# EAGLE design TdsReworkSMD (EAGLE 9.2.0)
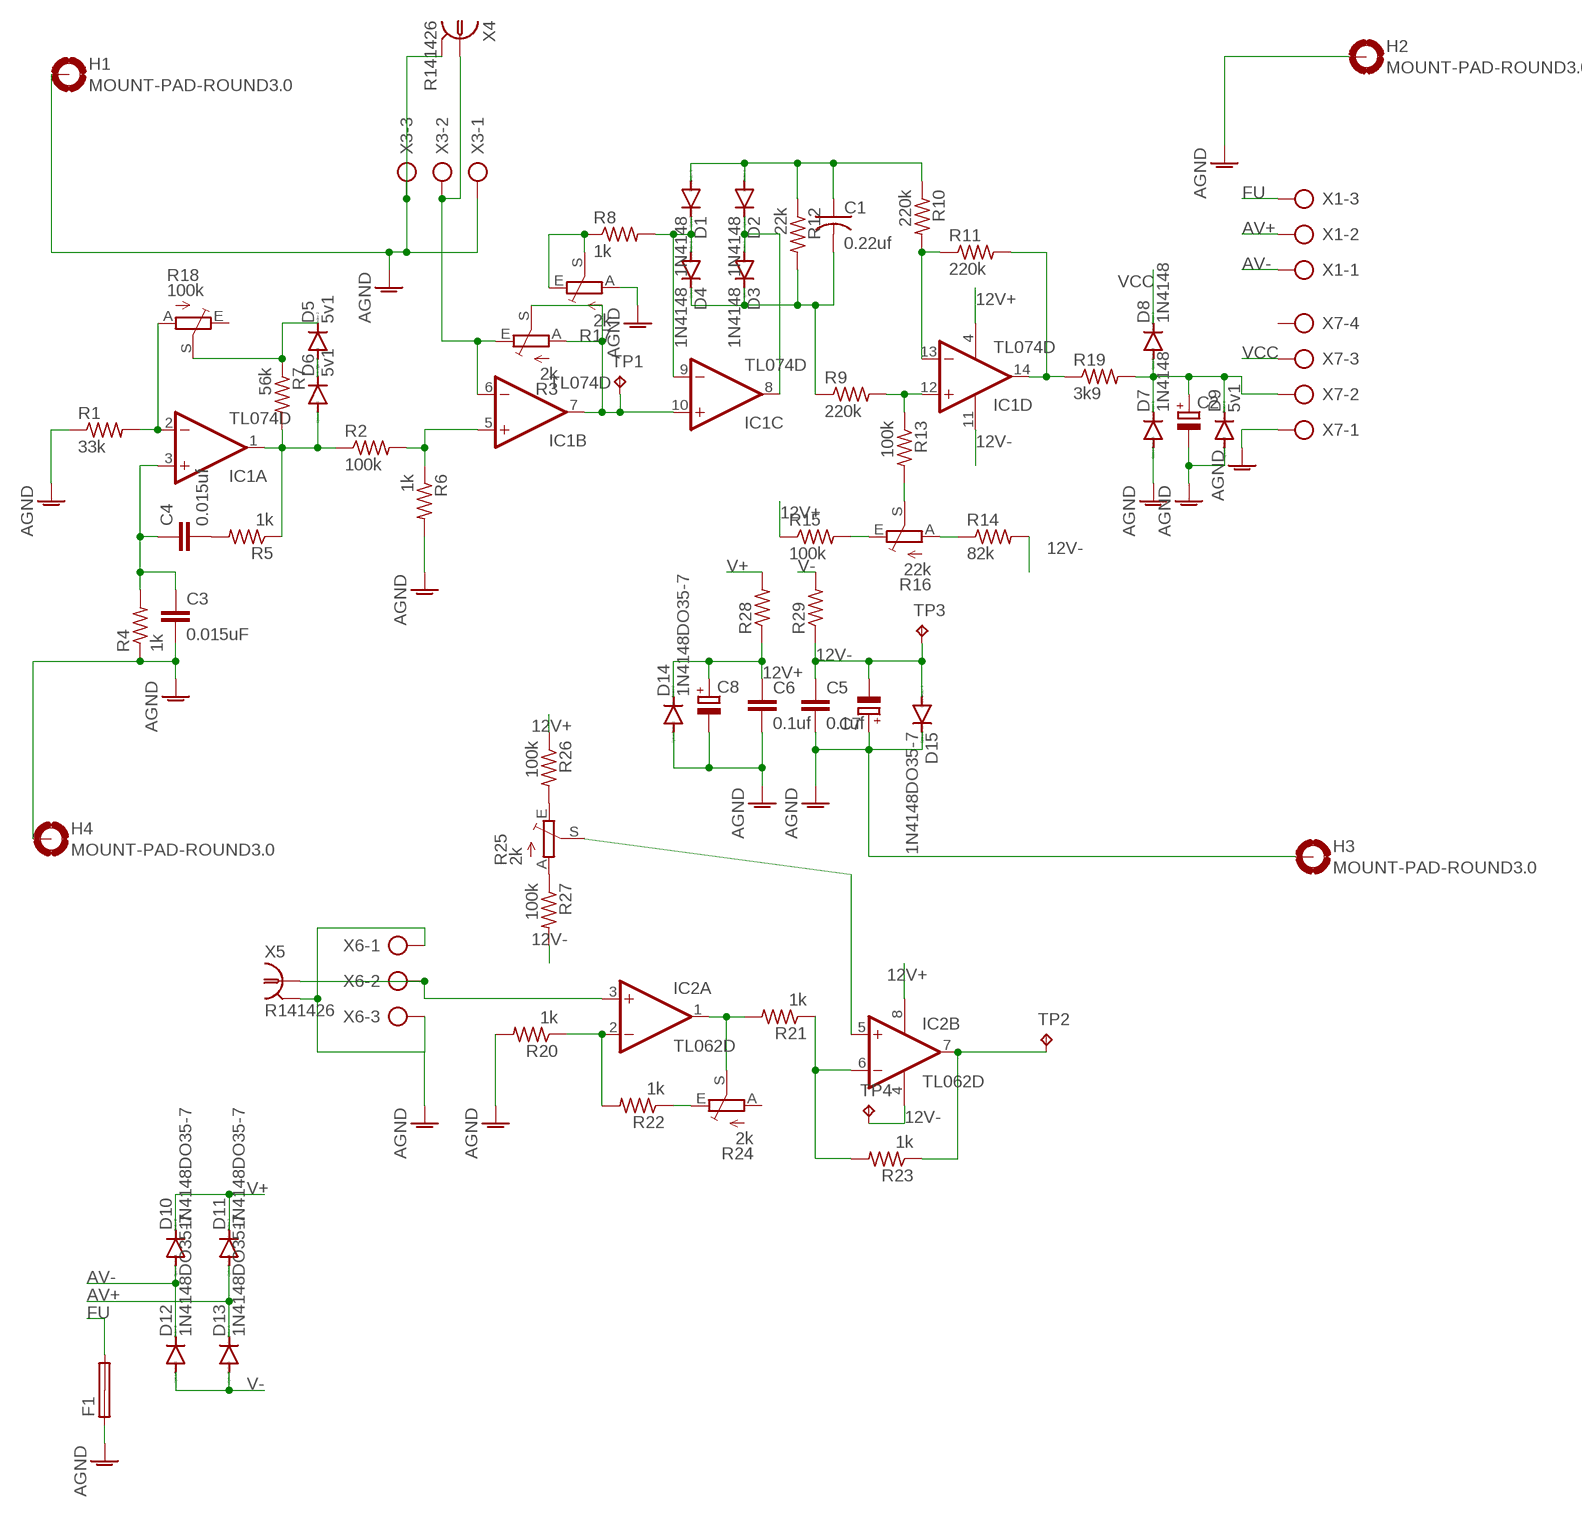
[diagram p0: schematic, sheet 1]

## Parts
C1  0.22uf  C-US075-032X103  [C075-032X103]
C2  CPOL-EUE5-8.5  [E5-8,5]
C3  0.015uF  C-EU050-024X044  [C050-024X044]
C4  0.015uf  C-EU050-024X044  [C050-024X044]
C5  0.1uf  C5/2.5  [C5B2.5]
C6  0.1uf  C5/2.5  [C5B2.5]
C7  CPOL-EUE5-8.5  [E5-8,5]
C8  CPOL-EUE5-8.5  [E5-8,5]
D1  1N4148  1N4148DO35-7  [DO35-7]
D2  1N4148  1N4148DO35-7  [DO35-7]
D3  1N4148  1N4148DO35-7  [DO35-7]
D4  1N4148  1N4148DO35-7  [DO35-7]
D5  5v1  1N4148DO35-7  [DO35-7]
D6  5v1  1N4148DO35-7  [DO35-7]
D7  1N4148  1N4148DO35-7  [DO35-7]
D8  1N4148  1N4148DO35-7  [DO35-7]
D9  5v1  1N4148DO35-10  [DO35-10]
D10  1N4148DO35-7  [DO35-7]
D11  1N4148DO35-7  [DO35-7]
D12  1N4148DO35-7  [DO35-7]
D13  1N4148DO35-7  [DO35-7]
D14  1N4148DO35-7  [DO35-7]
D15  1N4148DO35-7  [DO35-7]
F1  SHK20L  [SHK20L]
H1  MOUNT-PAD-ROUND3.0  [3,0-PAD]
H2  MOUNT-PAD-ROUND3.0  [3,0-PAD]
H3  MOUNT-PAD-ROUND3.0  [3,0-PAD]
H4  MOUNT-PAD-ROUND3.0  [3,0-PAD]
IC1  TL074D  [SO14]
IC2  TL062D  [SO08]
R1  33k  R-US_0204/5  [0204/5]
R2  100k  R-US_0204/5  [0204/5]
R3  2k  TRIM_EU-B64Y  [B64Y]
R4  1k  R-US_0204/5  [0204/5]
R5  1k  R-US_0204/5  [0204/5]
R6  1k  R-US_0204/5  [0204/5]
R7  56k  R-US_0204/2V  [0204V]
R8  1k  R-US_0204/5  [0204/5]
R9  220k  R-US_0204/5  [0204/5]
R10  220k  R-US_0204/5  [0204/5]
R11  220k  R-US_0204/5  [0204/5]
R12  22k  R-US_0204/5  [0204/5]
R13  100k  R-US_0204/5  [0204/5]
R14  82k  R-US_0204/5  [0204/5]
R15  100k  R-US_0204/5  [0204/5]
R16  22k  TRIM_EU-B64Y  [B64Y]
R17  2k  TRIM_EU-B64Y  [B64Y]
R18  100k  TRIM_EU-B64Y  [B64Y]
R19  3k9  R-US_0204/5  [0204/5]
R20  1k  R-US_0204/5  [0204/5]
R21  1k  R-US_0204/5  [0204/5]
R22  1k  R-US_0204/5  [0204/5]
R23  1k  R-US_0204/5  [0204/5]
R24  2k  TRIM_EU-B64Y  [B64Y]
R25  2k  TRIM_EU-B64Y  [B64Y]
R26  100k  R-US_0204/5  [0204/5]
R27  100k  R-US_0204/5  [0204/5]
R28  R-US_0309/10  [0309/10]
R29  R-US_0309/10  [0309/10]
TP1  TPPAD1-13  [P1-13]
TP2  TPPAD1-13  [P1-13]
TP3  TPPAD1-13  [P1-13]
TP4  TPPAD1-13  [P1-13]
X1  AK500/3  [AK500/3]
X3  AK500/3  [AK500/3]
X4  R141426  [R141426]
X5  R141426  [R141426]
X6  AK500/3  [AK500/3]
X7  AK500/4  [AK500/4]

## Nets
12V+: C6.1 C8.+ D14.C IC1.4(P:V+) IC2.8(P:V+) R15.1 R26.1 R28.1
12V-: C5.1 C7.- D15.A IC1.11(P:V-) IC2.4(P:V-) R14.2 R27.2 R29.1 TP3.TP TP4.TP
AGND: C2.- C3.2 C5.2 C6.2 C7.+ C8.- D7.A D9.A D14.A D15.C F1.1A H1.B3,0(MOUNT) H2.B3,0(MOUNT) H3.B3,0(MOUNT) H4.B3,0(MOUNT) R1.1 R4.1 R6.2 R17.A R20.2 X3.1 X3.3 X4.2 X4.3 X4.4 X4.5 X5.2 X5.3 X5.4 X5.5 X6.1 X6.3 X7.1
AV+: D11.A D13.C X1.2
AV-: D10.A D12.C X1.1
FU: F1.2A X1.3
N$1: IC1.2(A:-IN) R1.2 R18.A
N$2: IC1.6(B:-IN) R3.E X3.2 X4.1
N$3: IC1.5(B:+IN) R2.2 R6.1
N$4: D6.A IC1.1(A:OUT) R2.1 R5.1 R7.2
N$5: C3.1 C4.1 IC1.3(A:+IN) R4.2
N$6: IC2.1(A:OUT) R21.2 R24.S
N$7: IC1.7(B:OUT) IC1.10(C:+IN) R3.A R3.S TP1.TP
N$8: C4.2 R5.2
N$9: IC1.14(D:OUT) R11.2 R19.1
N$10: C1.1 D1.A D2.A R10.1 R12.1
N$11: D1.C D4.A IC1.9(C:-IN) R8.2
N$12: D2.C D3.A IC1.8(C:OUT)
N$13: IC1.13(D:-IN) R10.2 R11.1
N$14: IC1.12(D:+IN) R9.2 R13.1
N$15: D5.C R7.1 R18.S
N$16: C1.2 D3.C D4.C R9.1 R12.2
N$17: D5.A D6.C
N$18: R13.2 R16.S
N$19: R14.1 R16.A
N$20: R15.2 R16.E
N$21: R8.1 R17.E R17.S
N$22: C2.+ D7.C D8.A D9.C R19.2 X7.2
N$23: IC2.2(A:-IN) R20.1 R22.2
N$24: R22.1 R24.E
N$25: IC2.6(B:-IN) R21.1 R23.2
N$26: IC2.3(A:+IN) X5.1 X6.2
N$27: IC2.5(B:+IN) R25.S
N$28: IC2.7(B:OUT) R23.1 TP2.TP
N$29: R25.A R27.1
N$30: R25.E R26.2
V+: D10.C D11.C R28.2
V-: D12.A D13.A R29.2
VCC: D8.C X7.3
Unconnected: F1.1B F1.2B R18.E R24.A X7.4

## Library data of the parts
C1 = rcl:C-US: CAPACITOR, American symbol; SPICEPREFIX: C
C2 C7 C8 = rcl:CPOL-EU: POLARIZED CAPACITOR, European symbol; SPICEPREFIX: C
C3 C4 = rcl:C-EU: CAPACITOR, European symbol; SPICEPREFIX: C
C5 C6 = capacitor-wima:C: CAPACITOR naming: grid - package width
D1-D15 = diode:1N4148: DIODE high speed (Philips)
F1 = fuse:SHK20L: FUSE HOLDER 5 x 20 mm, SH contact, SHH1 Schukat, E1073 Buerklin; OC_FARNELL: unknown; OC_NEWARK: unknown
H1-H4 = holes:MOUNT-PAD-ROUND: MOUNTING PAD, round
IC1 = linear:TL074: OP AMP
IC2 = linear:TL062: OP AMP
R1 R2 R4-R15 R19-R23 R26-R29 = rcl:R-US_: RESISTOR, American symbol; SPICEPREFIX: R
R3 R16-R18 R24 R25 = pot:TRIM_EU-: POTENTIOMETER
TP1-TP4 = testpad:TP: Test pad
X1 X3 X6 = con-ptr500:AK500/3: CONNECTOR; OC_FARNELL: unknown; OC_NEWARK: unknown
X4 X5 = con-coax:R141426: BNC COAX CONNECTOR Radiall 50/75 Ohm Spoerle; MF: FARNELL; MPN: R141426161; OC_FARNELL: 4195115; OC_NEWARK: 14J7919
X7 = con-ptr500:AK500/4: CONNECTOR; OC_FARNELL: unknown; OC_NEWARK: unknown

## Board
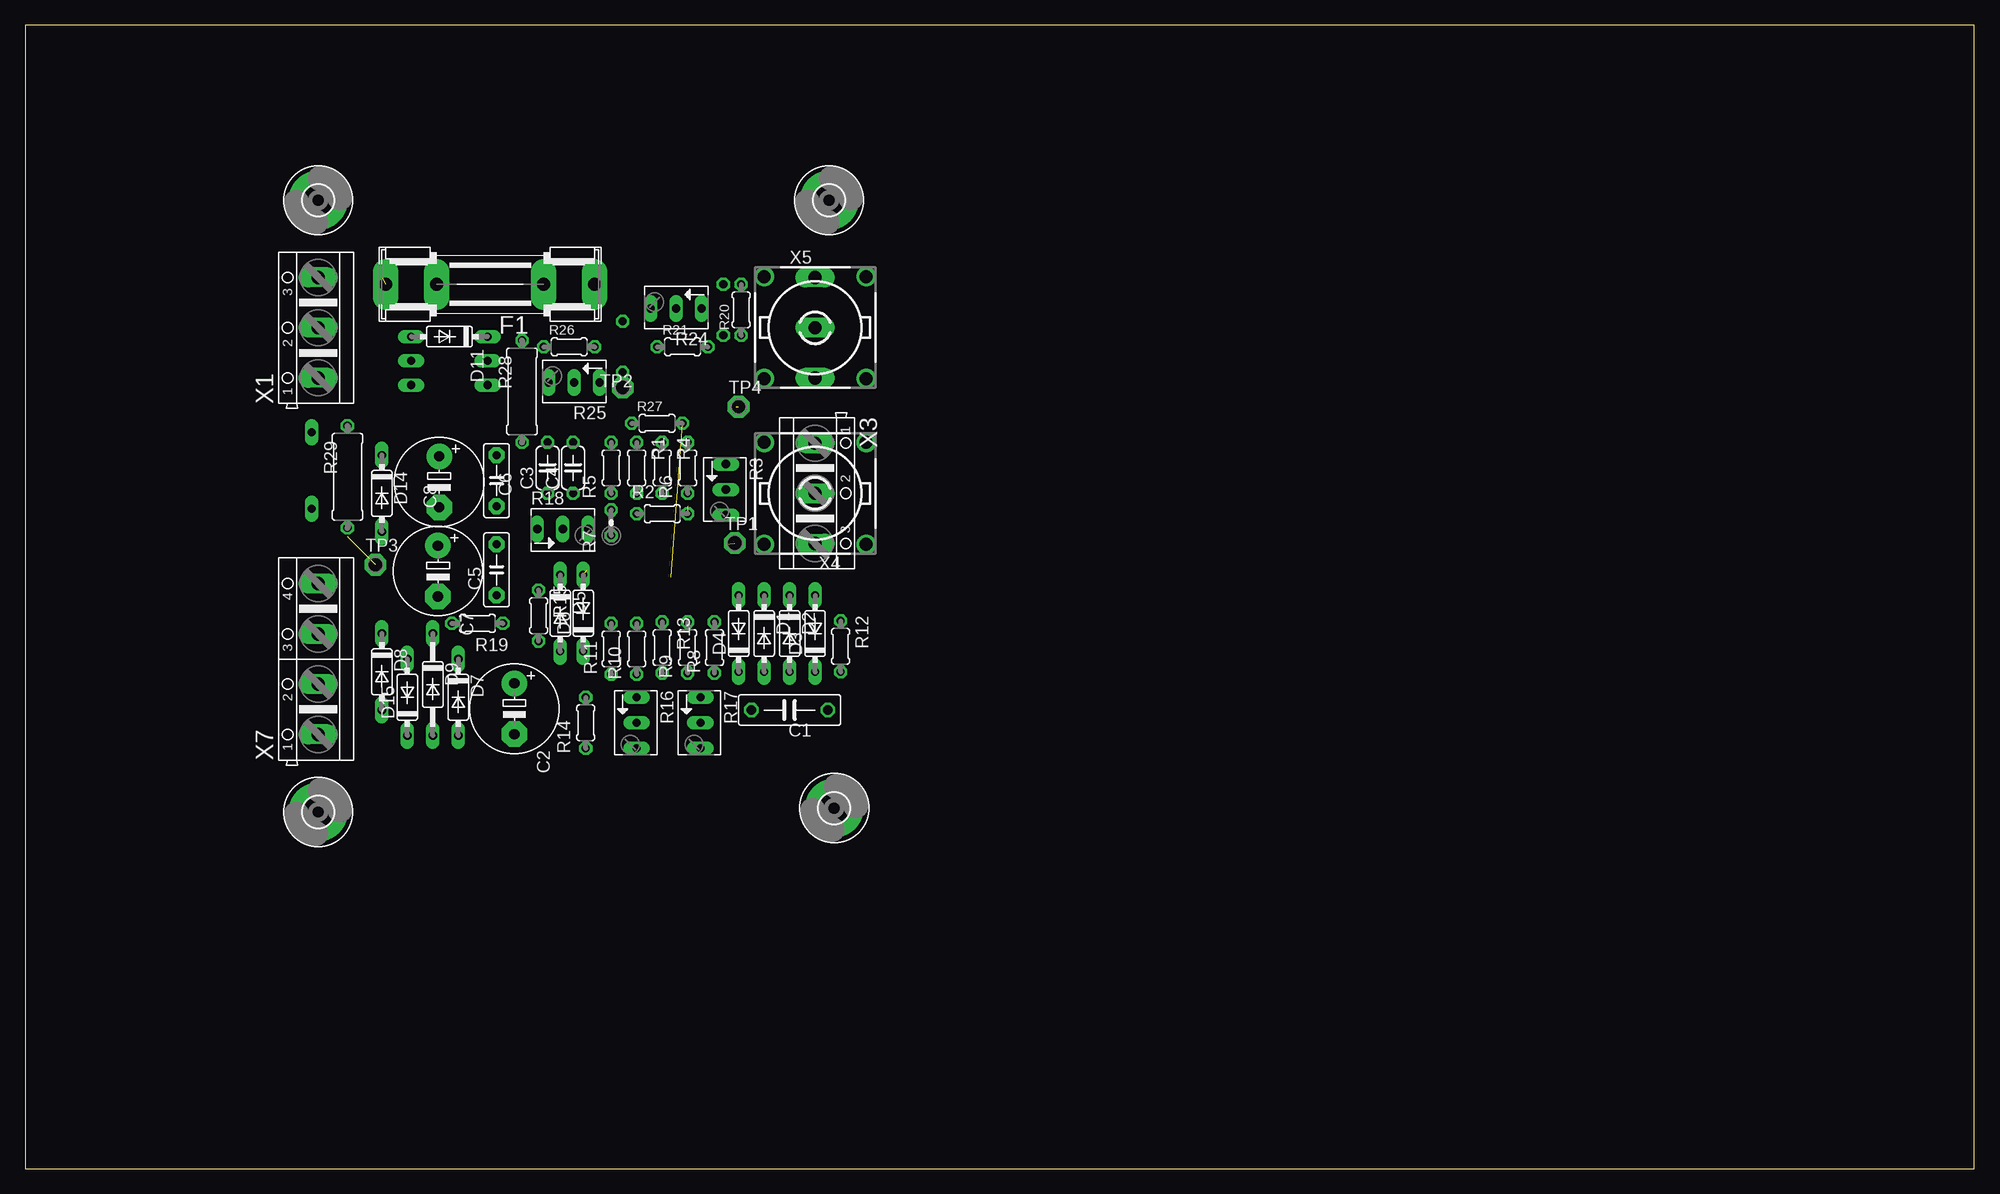
[diagram p1: board, top side]
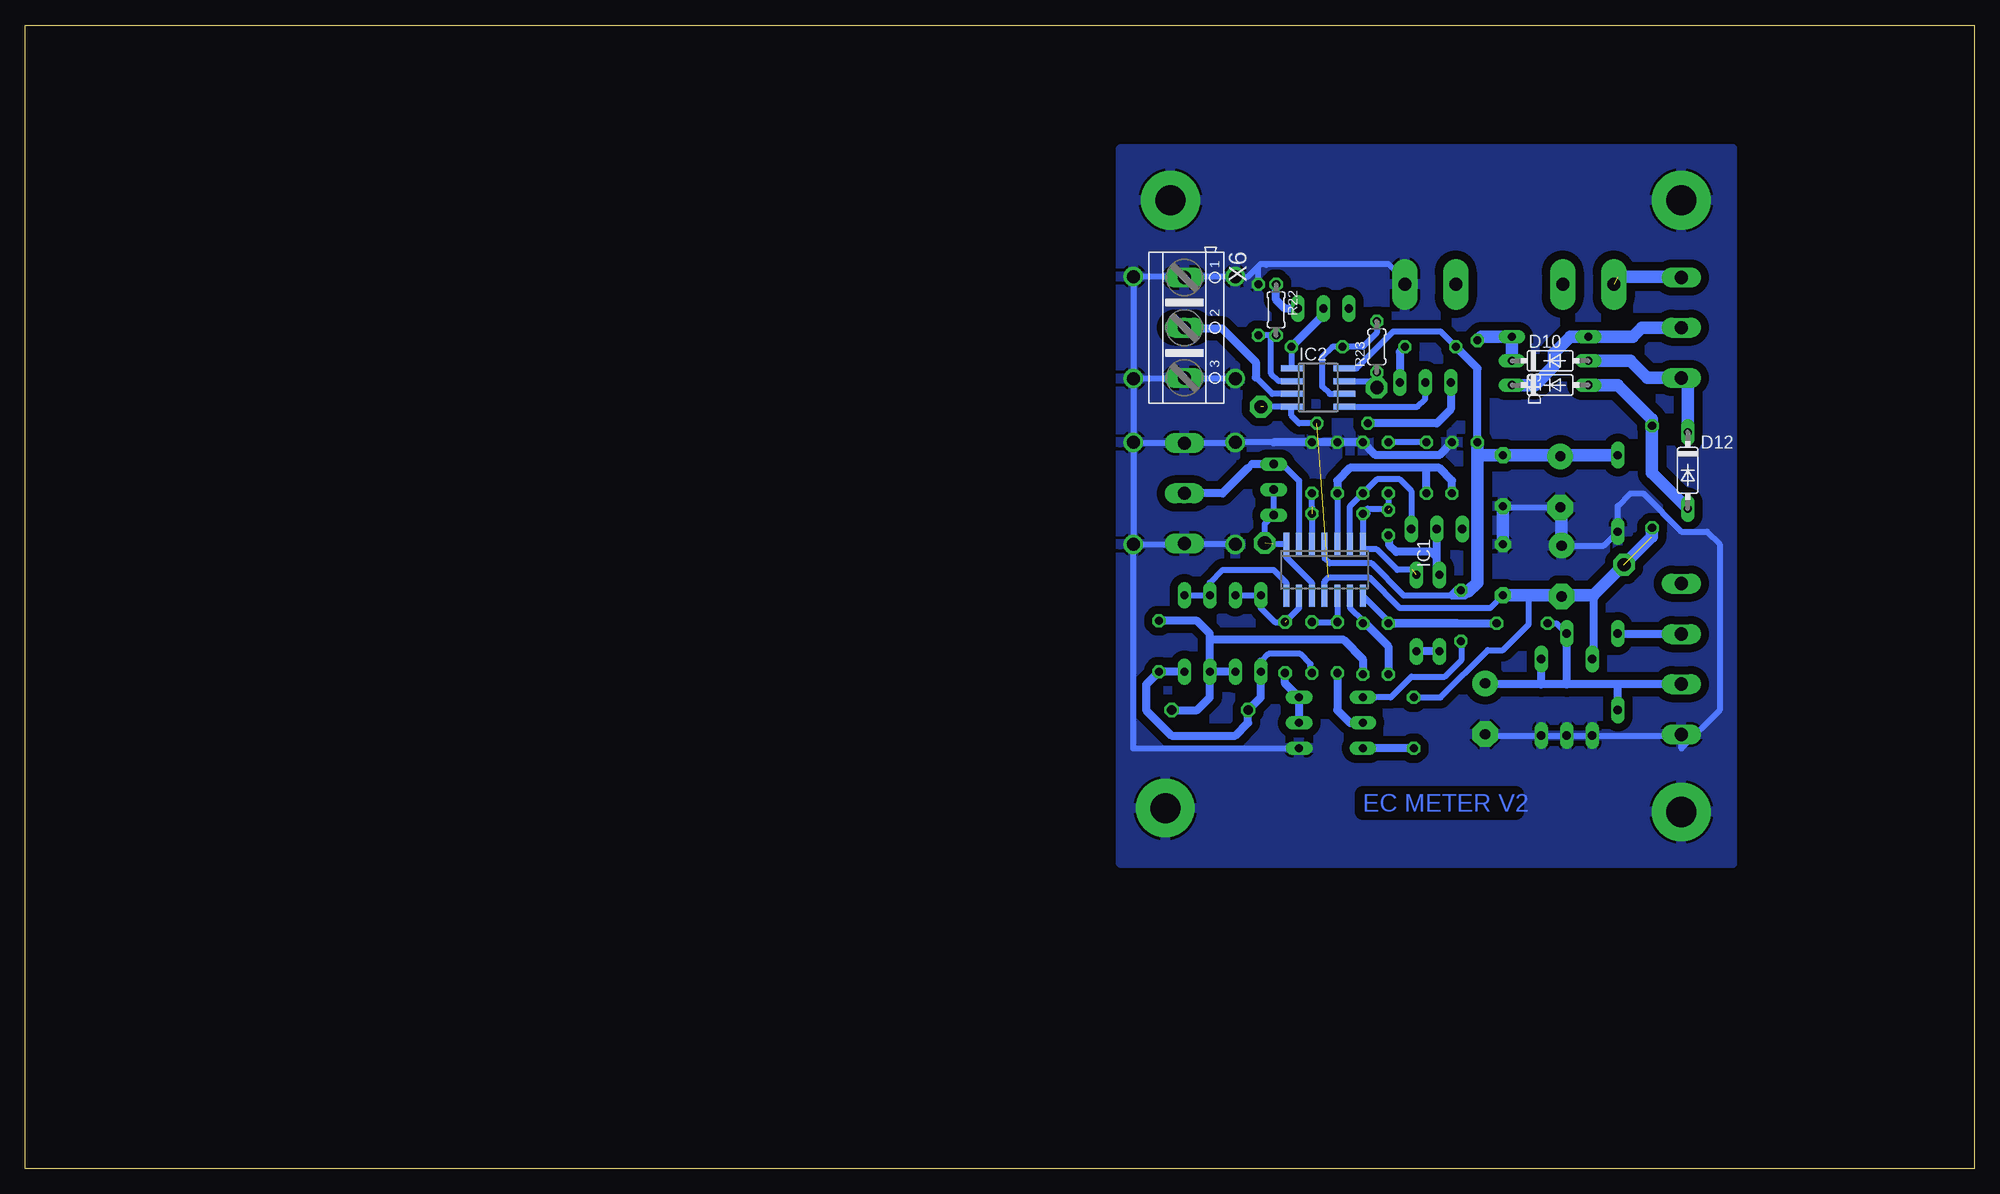
[diagram p2: board, bottom side, seen from below]

Size 194.29 x 113.97 mm. Coordinates in mm from the lower left corner, seen from the top.
Outline: 0,0 194.29,0 194.29,113.97 0,113.97 0,0
Copper layers (1*16): Top 0.035mm / dielectric 1.5mm / Bottom 0.035mm
Design rules "default *": minimum track width 6mil, minimum drill 0.35mm, track to track 8mil, track to pad 8mil, pad to pad 8mil, via to via 8mil, smd to smd 8mil, copper to edge 40mil, drill to drill 6mil, minimum pad ring 10mil, minimum via ring 8mil, stop-mask expansion 4mil, vias tented up to drill 0mil, thermal gap 10mil

### Footprints (pad centres in the part's own frame; a part is rotated, then mirrored left to right if it is on the bottom)
C075-032X103 = drill 0.914 octagon: 1 -3.81,0; 2 3.81,0
E5-8,5 = drill 1.016 pad 2.54: + -2.54,0 | drill 1.016 pad 2.54 octagon: - 2.54,0
C050-024X044 = drill 0.813 octagon: 1 -2.54,0; 2 2.54,0
C5B2.5 = drill 0.813 pad 1.6 octagon: 1 -2.54,0; 2 2.54,0
DO35-7 = drill 0.813 long: A 3.81,0; C -3.81,0
DO35-10 = drill 0.813 long: A 5.08,0; C -5.08,0
SHK20L = drill 1.321 pad 2.54 long: 1A -10.414,0; 1B -5.334,0; 2A 10.414,0; 2B 5.334,0
3,0-PAD = drill 3 pad 5.842: B3,0 0,0
SO14 = smd 0.6 x 2.2: 1 -3.81,-2.6; 2 -2.54,-2.6; 3 -1.27,-2.6; 4 0,-2.6; 5 1.27,-2.6; 6 2.54,-2.6; 7 3.81,-2.6; 8 3.81,2.6; 9 2.54,2.6; 10 1.27,2.6; 11 0,2.6; 12 -1.27,2.6; 13 -2.54,2.6; 14 -3.81,2.6
SO08 = smd 0.6 x 2.2: 1 -1.905,-2.6; 2 -0.635,-2.6; 3 0.635,-2.6; 4 1.905,-2.6; 5 1.905,2.6; 6 0.635,2.6; 7 -0.635,2.6; 8 -1.905,2.6
0204/5 = drill 0.813 octagon: 1 -2.54,0; 2 2.54,0
B64Y = drill 0.813 long: A 2.54,0; E -2.54,0; S 0,0
0204V = drill 0.813 octagon: 1 -1.27,0; 2 1.27,0
0309/10 = drill 0.813 octagon: 1 -5.08,0; 2 5.08,0
P1-13 = drill 1.321 pad 2.159 octagon: TP 0,0
AK500/3 = drill 1.321 long: 1 -5.004,0; 2 0,0; 3 5.004,0
R141426 = drill 1.295: 1 0,0; 2 5.08,5.08; 3 -5.08,5.08; 4 -5.08,-5.08; 5 5.08,-5.08
AK500/4 = drill 1.321 long: 1 -7.518,0; 2 -2.489,0; 3 2.489,0; 4 7.518,0

### Placement (x,y rotation side)
C1  76.2,45.72 180 top
C2  48.77,45.85 270 top
C3  52.07,69.85 90 top
C4  54.61,69.85 90 top
C5  46.99,59.69 90 top
C6  46.99,68.58 270 top
C7  41.15,59.56 270 top
C8  41.27,68.45 270 top
D1  73.66,53.34 270 top
D2  76.2,53.34 270 top
D3  78.74,53.34 90 top
D4  71.12,53.34 90 top
D5  53.34,55.37 270 top
D6  55.63,55.37 90 top
D7  43.18,46.99 270 top
D8  35.56,49.53 270 top
D9  40.64,48.26 270 top
D10  42.29,80.52 0 bottom
D11  42.29,82.93 180 top
D12  28.57,69.6 270 bottom
D13  42.29,78.11 0 bottom
D14  35.56,67.31 270 top
D15  38.1,46.99 90 top
F1  46.35,88.14 180 top
H1  80.14,96.52 0 top
H2  29.21,35.56 0 top
H3  80.64,35.94 0 top
H4  29.21,96.52 0 top
IC1  64.77,59.69 180 bottom
IC2  65.41,77.85 270 bottom
R1  60.96,69.85 270 top
R2  63.5,65.28 0 top
R3  69.85,67.69 270 top
R4  63.5,69.85 270 top
R5  58.42,69.85 90 top
R6  66.04,69.85 90 top
R7  58.42,64.39 90 top
R8  68.71,51.94 90 top
R9  66.04,51.94 90 top
R10  60.96,51.82 90 top
R11  58.42,51.82 90 top
R12  81.28,52.07 270 top
R13  63.5,51.94 270 top
R14  55.88,44.45 90 top
R15  51.18,55.12 270 top
R16  60.96,44.45 270 top
R17  67.31,44.45 270 top
R18  53.59,63.75 0 top
R19  45.09,54.36 180 top
R20  71.37,85.6 90 top
R21  65.53,81.92 0 top
R22  69.6,85.6 270 bottom
R23  59.56,81.92 90 bottom
R24  64.9,85.72 180 top
R25  54.74,78.36 180 top
R26  54.23,81.92 0 top
R27  62.99,74.3 0 top
R28  49.53,77.47 90 top
R29  32.13,68.96 90 top
TP1  70.74,62.36 0 top
TP2  59.56,77.85 0 top
TP3  34.92,60.2 0 top
TP4  71.12,75.95 0 top
X1  29.21,83.82 90 top
X3  78.74,67.31 270 top
X4  78.74,67.31 180 top
X5  78.74,83.82 0 top
X6  78.74,83.82 270 bottom
X7  29.21,50.8 90 top

### Tracks (layer width: path | path; a pad name or v marks a point on that pad's centre or on a via)
12V+
  Bottom 0.61: C8.+ 46.86,70.99 C6.1 48.26,71.12 | 41.53,71.25 C8.+ | C8.+ 35.69,70.99 D14.C | 64.77,60.96 IC1.4 64.77,60.83 64.26,60.33 60.07,60.33 56.9,57.15 52.07,57.15 | 49.53,58.42 49.53,71.12 R28.1 49.53,79.76 | R15.1 50.8,57.28 50.8,57.15 | R26.1 53.21,83.44 57.91,83.44 61.59,79.76 IC2.8
  Bottom 0.813: 49.02,71.12 49.53,71.12 49.53,79.76 R26.1 | 50.42,57.53 50.8,57.15 52.07,57.15 51.56,57.66 R15.1
  Bottom 1.27: D14.C 48.26,71.12 49.02,71.12 | R28.1 49.53,58.42 50.42,57.53
12V-  (3 unrouted)
  Bottom 0.61: 37.97,57.15 41.02,57.15 C7.- 41.27,57.15 44.45,57.15 | 64.77,58.42 IC1.11 64.77,58.55 64.39,58.93 60.33,58.93 57.28,55.88 48.26,55.88 C5.1 | 53.44,46.99 R14.2 53.21,46.99 48.51,51.69 46.99,51.69 44.45,54.23 44.45,56.77 44.83,57.15 46.74,57.15 | 68.71,75.95 IC2.4 | R27.2 67.31,74.3 68.07,75.06 68.07,75.88 IC2.4 | IC2.4 70.87,75.95 71.12,76.2 | 37.97,57.15
  Bottom 0.813: C5.1 46.74,57.15 44.45,57.15 37.97,57.15 37.97,50.93 D15.A
  Bottom 1.27: R29.1 32.13,62.99 37.97,57.15 46.74,57.15
AGND
  Bottom 0.61: R1.1 R4.1 R6.2 69.85,72.39 X4.5 73.74,72.31 X3.1 83.74,72.31 X4.4 | X4.4 X4.3 | X4.3 78.82,62.23 X3.3 73.74,62.31 X4.2 | R17.A 83.82,41.91 X4.3 | C6.2 46.86,65.91 C8.- | 29.21,43.18 D9.A 48.26,43.18 | X5.5 X5.2 X5.3 72.39,88.9 71.5,89.79 | X5.5 X4.4 | X5.4 X5.5 | C7.+ 36.96,62.1 D14.A 35.56,66.04 34.29,67.31 33.02,67.31 29.21,63.5 26.67,63.5 25.4,62.23 25.4,45.72 29.21,41.91 29.21,43.18 | 29.21,43.18 X7.1 | 71.5,89.79 71.12,90.17 70.48,90.17 | 70.48,90.17 58.42,90.17 56.77,88.52 F1.1A | 70.61,90.04 70.48,90.17 | R20.2 71.37,89.66 71.5,89.79
  Bottom 0.813: C3.2 53.34,71.12 59.69,71.12 R1.1 69.85,72.39
  Bottom 1.27: C8.- 41.15,65.79 C7.+ | C6.2 C5.2
  pour Bottom (isolate 0.813): 24.13,101.6 85.09,101.6 85.09,30.48 24.13,30.48
AV+
  Bottom 0.61: 34.04,82.93 34.29,82.93
  Bottom 1.27: X1.2 33.15,83.82 34.04,82.93 | 34.29,82.93 D11.A 40.26,82.93 41.91,81.28 41.91,80.01 43.81,78.11 D13.C
AV-
  Bottom 0.61: X1.1 29.29,78.74
  Bottom 1.27: D10.A 34.29,80.52 32.59,78.82 X1.1 28.57,78.18 D12.C
FU  (1 unrouted)
  Bottom 1.27: X1.3 29.29,88.9 35.56,88.9
N$1
  Bottom 0.61: IC1.2 62.23,66.04 R1.2 | R1.2 59.69,68.58 | R1.2 59.56,68.71 57.28,68.71 56.13,67.56 R18.A
N$2
  Bottom 0.61: R3.E 68.96,70.23 67.31,68.58 IC1.6 | 72.01,70.23 72.39,69.85
  Bottom 0.813: R3.E 72.01,70.23 | 72.39,69.85 74.93,67.31 X3.2
N$3  (1 unrouted)
  Bottom 0.61: 66.04,66.04 IC1.5 | R2.2 R6.1
N$4  (3 unrouted)
  Bottom 0.61: 60.45,65.28 R2.1 | R2.1 IC1.1 60.96,61.85 60.83,61.72 59.56,61.72 57.53,59.69 56.01,59.69 55.75,58.17 | R2.1 60.45,65.79 58.29,65.79 | R5.1 58.42,65.68
N$5
  Bottom 0.61: R4.2 IC1.3
  Bottom 0.813: C3.1 52.07,68.58 53.34,69.85 54.61,69.85 | 54.61,69.85 62.23,69.85 63.5,68.58 R4.2 | C4.1 54.61,69.85
N$6
  Bottom 0.61: R21.2 68.07,79.82 IC2.1 | 64.9,85.09 R24.S
  Bottom 0.813: R21.2 64.9,85.09
N$7  (1 unrouted)
  Bottom 0.61: 68.64,62.23 IC1.7 68.58,60.96 66.04,58.42 IC1.10 | 68.64,62.23 69.85,62.23 | TP1.TP 70.74,64.26 R3.A R3.S | 68.58,62.17 68.64,62.23
N$8
  Bottom 0.61: C4.2 R5.2
N$9
  Bottom 0.61: IC1.14 58.42,54.55 | 58.42,54.55 R11.2 | 58.35,54.48 58.42,54.55 | 51.56,54.48 58.35,54.48 | R19.1 58.23,54.36 58.35,54.48
  Bottom 0.813: R11.2 R19.1
N$10
  Bottom 0.813: C1.1 77.47,45.72 76.2,46.99 D2.A | R12.1 77.47,54.61 76.2,53.34 76.2,52.7 | D2.A 76.2,52.7 | R10.1 60.96,50.8 62.86,52.7 76.2,52.7 | D1.A D2.A
N$11  (1 unrouted)
  Bottom 0.61: D1.C D4.A 71.12,55.88 69.72,54.48 R8.2 | 67.31,57.15 IC1.9 67.31,55.88 68.58,54.61
N$12
  Bottom 0.61: D3.A D2.C 76.2,58.42 74.93,59.69 69.85,59.69 68.58,58.42 IC1.8
N$13
  Bottom 0.61: IC1.13 62.23,55.88 60.96,54.61 | 60.96,54.61 R10.2 | 58.42,52.07 60.96,54.61
  Bottom 0.813: R10.2 60.71,54.36 58.42,52.07 R11.1
N$14
  Bottom 0.61: R9.2 R13.1 IC1.12
N$15
  Bottom 0.61: 53.59,62.99 R18.S 53.59,61.47 | 57.66,61.47 53.72,61.47
  Bottom 0.813: D5.C 53.59,59.44 53.59,60.96 | 53.59,60.96 R18.S | 53.59,60.96 54.1,61.47 57.66,61.47 58.29,62.1 58.29,63.25 R7.1
N$16
  Bottom 0.61: D3.C 80.01,49.53 | 81.28,44.45 80.01,43.18 | R9.1 66.17,49.53 66.17,50.29 67.18,51.31 70.36,51.31 71.12,50.55
  Bottom 0.813: 66.04,49.53 R9.1 | 71.12,50.55 D4.C 71.12,46.99 C1.2 72.39,44.45 73.66,43.18 80.01,43.18 82.55,45.72 82.55,48.26 R12.2 D3.C
N$17
  Bottom 0.813: D5.A D6.C
N$18
  Bottom 0.813: R13.2 63.5,45.72 62.23,44.45 R16.S
N$19
  Bottom 0.813: R14.1 R16.A
N$20
  Bottom 0.61: 59.69,46.99 R16.E 58.17,46.99 56.11,49.05 52.78,49.05 51.16,50.67 51.16,52.55 R15.2
N$21
  Bottom 0.813: R17.S R17.E 68.71,48.39 R8.1
N$22
  Bottom 0.61: 48.89,48.26 43.18,48.26 40.64,48.26 35.56,48.26 29.26,48.26 X7.2 | 49.53,48.26 48.89,48.26 | 48.89,48.26 C2.+ | R19.2 41.66,54.36 D9.C
  Bottom 0.813: X7.2 48.84,48.31 48.89,48.26 | 43.18,48.26 D7.C | 40.64,48.26 D9.C | D8.A 35.56,48.26
N$23
  Bottom 0.61: R22.2 70.23,83.06 | 70.23,83.06 R20.1 | IC2.2 69.34,78.49 70.1,79.25 70.1,82.93 70.23,83.06
N$24
  Bottom 0.61: R24.E 67.44,85.22
  Bottom 0.813: R24.E 68.71,85.72 69.6,86.61 R22.1
N$25
  Bottom 0.61: IC2.6 64.26,77.22 65.02,77.98 65.02,80.9 64.01,81.92 R21.1 60.96,81.92 59.56,83.31 R23.2
N$26
  Bottom 0.61: IC2.3 69.98,77.22 71.63,78.87 | 78.99,83.82 78.93,83.76 78.68,83.76
  Bottom 0.813: X5.1 78.68,83.76 74.99,83.76 71.63,80.39 71.63,78.87
N$27
  Bottom 0.61: IC2.5 55.5,75.95 54.74,76.71 R25.S
N$28
  Bottom 0.61: R23.1 TP2.TP 60.2,78.49 IC2.7
N$29
  Bottom 0.813: R25.A 52.2,75.69 53.59,74.3 R27.1
N$30
  Bottom 0.813: R26.2 57.28,81.41 R25.E
V+
  Bottom 1.27: D10.C D11.C 49.15,82.93 R28.2
V-
  Bottom 0.61: 32.13,74.55 R29.2
  Bottom 1.27: D13.A 35.56,78.11 32.13,74.68 R29.2 32.13,69.34 D12.A
VCC
  Bottom 0.61: D8.C 30.56,53.34
  Bottom 0.813: X7.3 35.51,53.29 D8.C

### Text on the board
Bottom: EC METER V2